# Altium schematic sheet 80_TY_Zigbee.SchDoc: P30L
size A4; Organization: 六零加智能科技; Address4: www.nidone.com.cn; DocumentNumber: Kang jin; Revision: 1.0; SheetNumber: 22; SheetTotal: 23
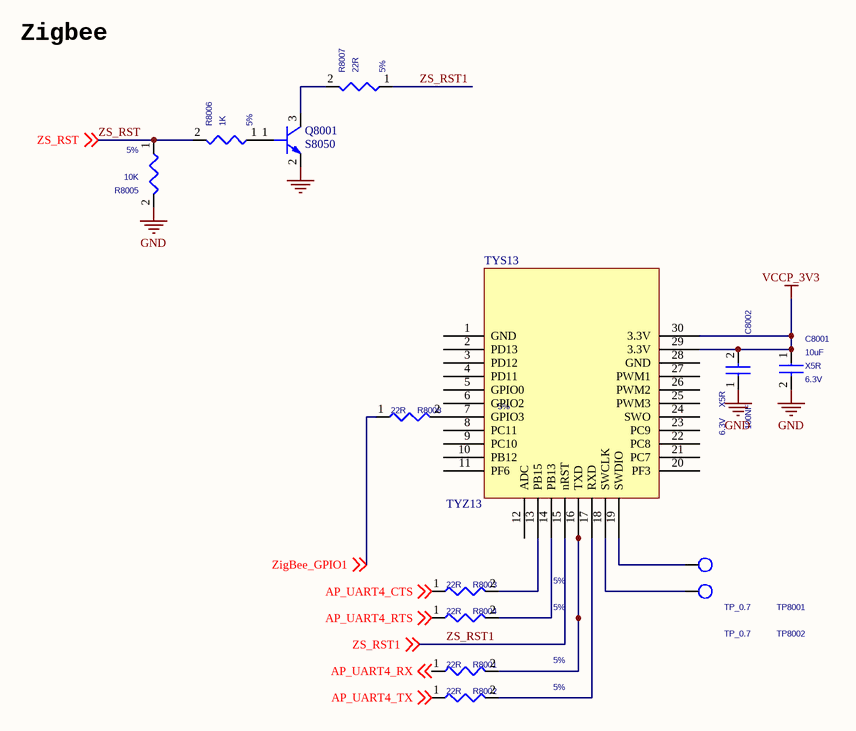
[diagram p0: 80_TY_Zigbee.SchDoc]

## Parts
C8001  10uF  Voltage: 6.3V  Dielectric: X5R  [C0603]
C8002  100NF  Voltage: 6.3V  Dielectric: X5R  [C0402]
Q8001  S8050  [SOT23]
R8001  22R  Tolerance: 5%  [R0402]
R8002  22R  Tolerance: 5%  [R0402]
R8003  22R  Tolerance: 5%  [R0402]
R8004  22R  Tolerance: 5%  [R0402]
R8005  10K  Tolerance: 5%  [R0402]
R8006  1K  Tolerance: 5%  [R0402]
R8007  22R  Tolerance: 5%  [R0402]
R8008  22R  Tolerance: 5%  [R0402]
TP8001  TP_0.7  [TEST]
TP8002  TP_0.7  [TEST]
TYS13  TYZ13  [TYS13]

## Nets
GND: C8001.2 C8002.1 Q8001.2(EMITTER) R8005.2
VCCP_3V3: C8001.1 C8002.2 TYS13.29(3.3V) TYS13.30(3.3V)
AP_UART4_CTS: R8003.1 ; off-sheet AP_UART4_CTS
AP_UART4_RTS: R8004.1 ; off-sheet AP_UART4_RTS
AP_UART4_RX: R8001.1 ; off-sheet AP_UART4_RX
AP_UART4_TX: R8002.1 ; off-sheet AP_UART4_TX
ZigBee_GPIO1: R8008.1 ; off-sheet ZigBee_GPIO1
ZS_RST: R8005.1 R8006.2 ; off-sheet ZS_RST
ZS_RST1: R8007.1 TYS13.15(nRST) ; off-sheet ZS_RST1
NetQ8001_1: Q8001.1(BASE) R8006.1
NetQ8001_3: Q8001.3(COLLECTOR) R8007.2
NetR8001_2: R8001.2 TYS13.16(TXD)
NetR8002_2: R8002.2 TYS13.17(RXD)
NetR8003_2: R8003.2 TYS13.13(PB15)
NetR8004_2: R8004.2 TYS13.14(PB13)
NetR8008_2: R8008.2 TYS13.7(GPIO3)
NetTP8001_1: TP8001.1 TYS13.19(SWDIO)
NetTP8002_1: TP8002.1 TYS13.18(SWCLK)

Not connected (* = marked no-connect by the designer): TYS13 1(GND) 2(PD13) 3(PD12) 4(PD11) 5(GPIO0) 6(GPIO2) 8(PC11) 9(PC10) 10(PB12) 11(PF6) 12(ADC) 20(PF3) 21(PC7) 22(PC8) 23(PC9) 24(SWO) 25(PWM3) 26(PWM2) 27(PWM1) 28(GND)

## Notes on the sheet
- Zigbee
- Title
- Size:
- Date:
- A4
- Engineer:
- Time:
- Revision:
- Sheet
- of
- File:

## Library data of the parts
C8001 = CAP NP_Dup1: cap,10uF,+/-20%,6.3V,X5R,C0603; Manufacturer PN: C1608X5R0J106M080AC; Manufacturer: TDK; Tolerance: 20%; Priority: A; Created by: JJJ; Part Type: C0603; RK PN: C1608X5R0J106M080AC
C8002 = CAP NP_Dup1: cap,100.00nF,+/-10%,6.3V,X5R,C0402; Manufacturer PN: C1005X5R0J104K050BA; Manufacturer: TDK; Tolerance: 10%; Priority: A; Created by: JJJ; Part Type: C0402; RK PN: C1005X5R0J104K050BA
Q8001 = NPN
R8001-R8004 R8008 = RESISTOR_Dup1: 通用厚膜电阻,22R,+/-5%,R0402,1/16W.; Manufacturer: YAGEO; RK PN: RC0402JR-0722RL; Priority: A; Wattage: 1/16W; Part Type: 通用厚膜电阻; Manufacturer PN: RC0402JR-0722RL; Created by: YTL
R8005 R8006 = RESISTOR_Dup1: 通用厚膜电阻,1K,+/-5%,R0402,1/16W.; Manufacturer PN: RC0402JR-072KL; Manufacturer: YAGEO; Wattage: 1/16W; Priority: A; Created by: YTL; Part Type: 通用厚膜电阻; RK PN: RC0402JR-072KL
R8007 = RESISTOR_Dup1: 通用厚膜电阻,22R,+/-5%,R0402,1/16W.; Manufacturer PN: RC0402JR-072KL; Manufacturer: YAGEO; Wattage: 1/16W; Priority: A; Created by: YTL; Part Type: 通用厚膜电阻; RK PN: RC0402JR-072KL
TP8001 TP8002 = TP: Test Point 0.7mm; RK PN: TESTPOINT_0R7; Priority: A; Part Type: TP; Created by: JJJ
TYS13 = TYZS13